# EAGLE design binary_watch_shield_v1 (EAGLE 6.5.0)
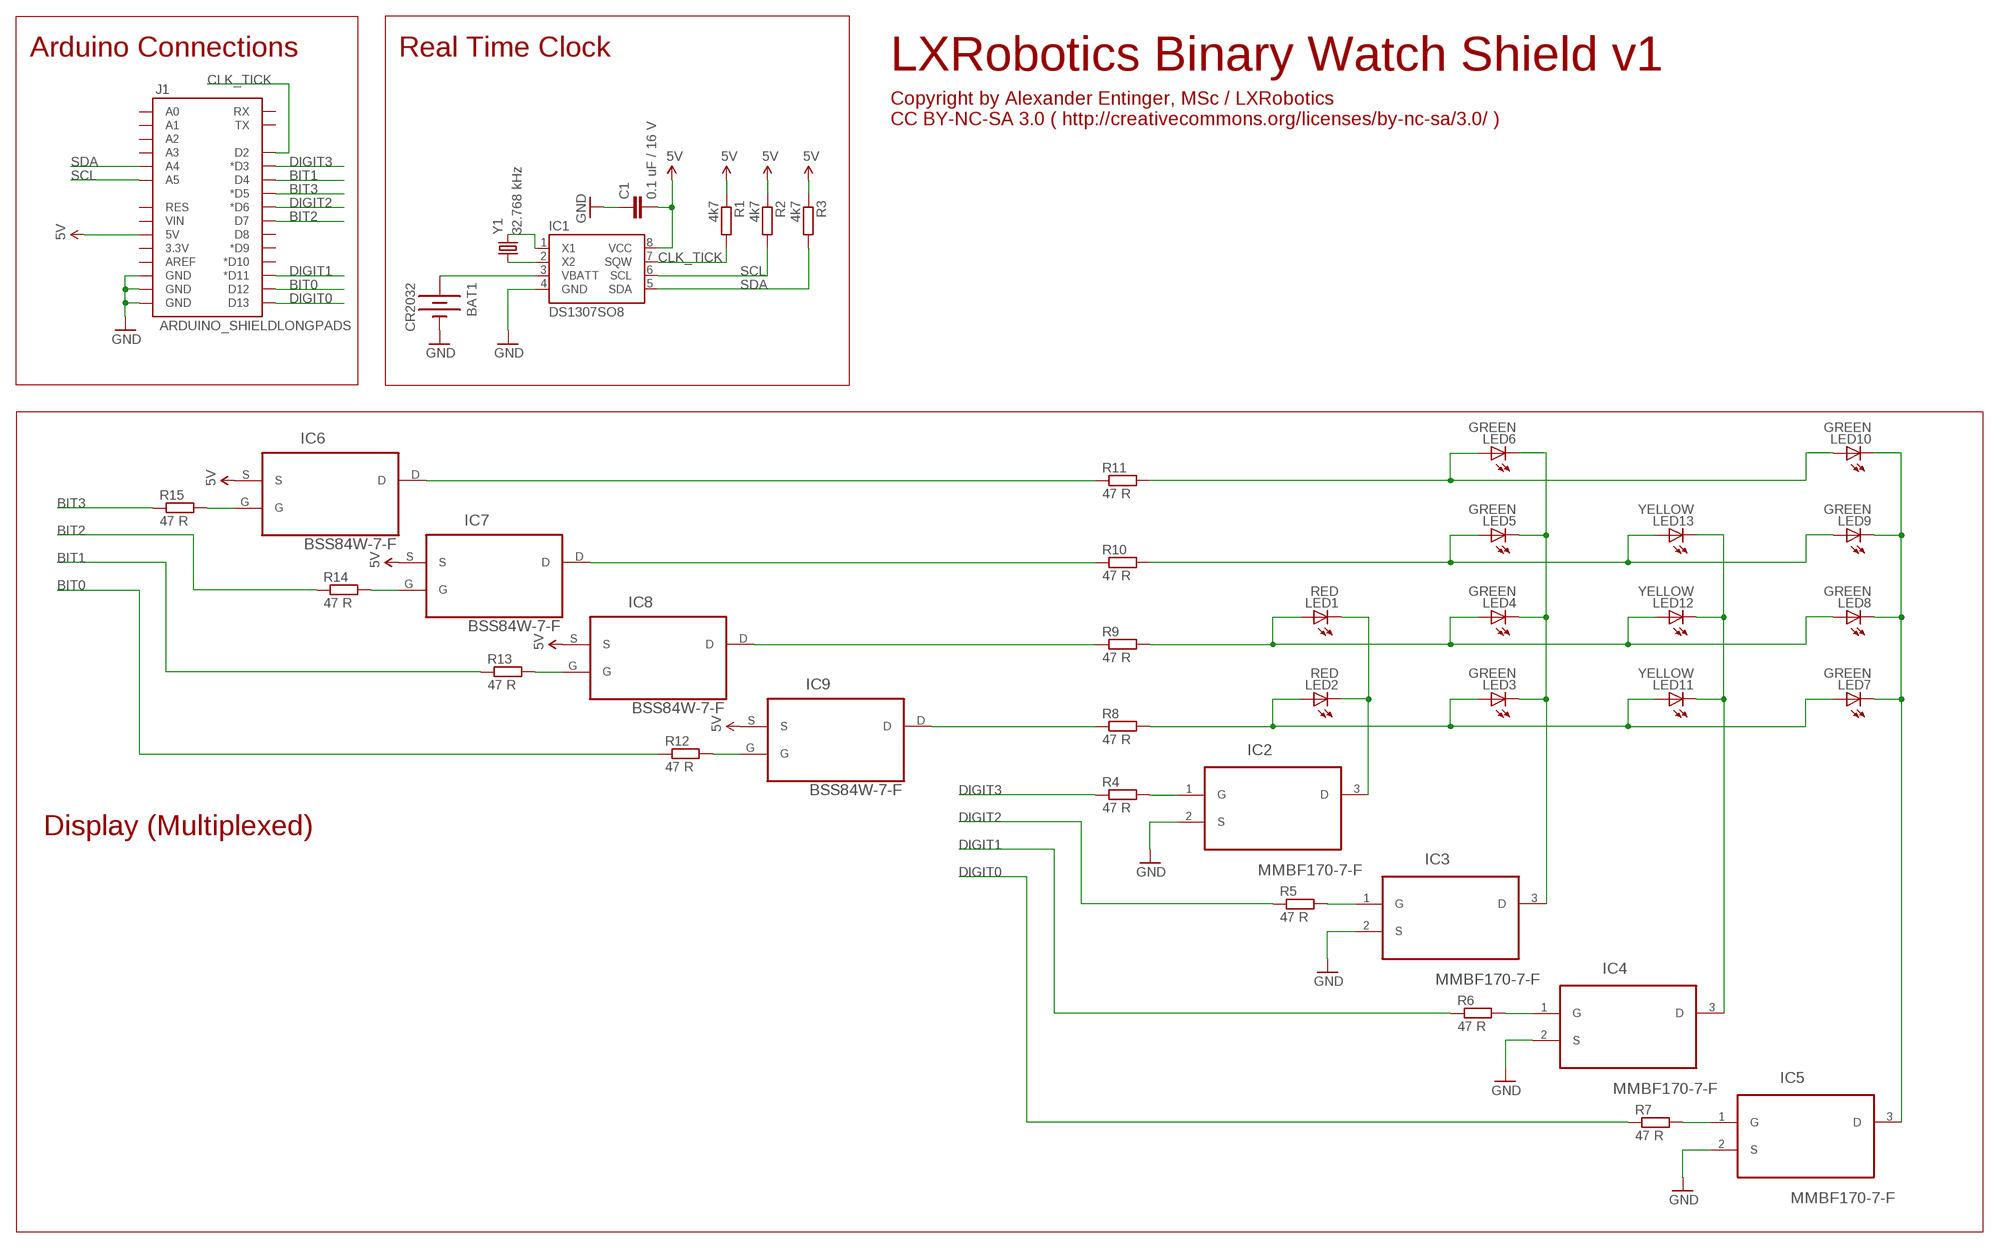
[diagram p0: schematic, sheet 1]

## Parts
BAT1  CR2032  BATTERY20SMD  [BATTCON_20MM]
C1  0.1 uF / 16 V  C-EUC0805  [C0805]
IC1  DS1307SO8  [SO08]
IC2  MMBF170-7-F  [SOT103P240X110-3N]
IC3  MMBF170-7-F  [SOT103P240X110-3N]
IC4  MMBF170-7-F  [SOT103P240X110-3N]
IC5  MMBF170-7-F  [SOT103P240X110-3N]
IC6  BSS84W-7-F  [SOT65P210X110-3N]
IC7  BSS84W-7-F  [SOT65P210X110-3N]
IC8  BSS84W-7-F  [SOT65P210X110-3N]
IC9  BSS84W-7-F  [SOT65P210X110-3N]
J1  ARDUINO_SHIELDLONGPADS  [DUEMILANOVE_SHIELD_LONGPADS]
LED1  RED  LED5MM  [LED5MM]
LED2  RED  LED5MM  [LED5MM]
LED3  GREEN  LED5MM  [LED5MM]
LED4  GREEN  LED5MM  [LED5MM]
LED5  GREEN  LED5MM  [LED5MM]
LED6  GREEN  LED5MM  [LED5MM]
LED7  GREEN  LED5MM  [LED5MM]
LED8  GREEN  LED5MM  [LED5MM]
LED9  GREEN  LED5MM  [LED5MM]
LED10  GREEN  LED5MM  [LED5MM]
LED11  YELLOW  LED5MM  [LED5MM]
LED12  YELLOW  LED5MM  [LED5MM]
LED13  YELLOW  LED5MM  [LED5MM]
R1  4k7  R-EU_R0805  [R0805]
R2  4k7  R-EU_R0805  [R0805]
R3  4k7  R-EU_R0805  [R0805]
R4  47 R  R-EU_R0805  [R0805]
R5  47 R  R-EU_R0805  [R0805]
R6  47 R  R-EU_R0805  [R0805]
R7  47 R  R-EU_R0805  [R0805]
R8  47 R  R-EU_R0805  [R0805]
R9  47 R  R-EU_R0805  [R0805]
R10  47 R  R-EU_R0805  [R0805]
R11  47 R  R-EU_R0805  [R0805]
R12  47 R  R-EU_R0805  [R0805]
R13  47 R  R-EU_R0805  [R0805]
R14  47 R  R-EU_R0805  [R0805]
R15  47 R  R-EU_R0805  [R0805]
Y1  32.768 kHz  CRYSTALTC26H_EZ  [TC26HEZ]

## Nets
5V: C1.2 IC1.8(VCC) IC6.S IC7.S IC8.S IC9.S J1.5V R1.1 R2.1 R3.1
BIT0: J1.D12 R12.1
BIT1: J1.D4 R13.1
BIT2: J1.D7 R14.1
BIT3: J1.D5(*D5) R15.1
CLK_TICK: IC1.7(SQW) J1.D2 R1.2
DIGIT0: J1.D13 R7.1
DIGIT1: J1.D11(*D11) R6.1
DIGIT2: J1.D6(*D6) R5.1
DIGIT3: J1.D3(*D3) R4.1
GND: BAT1.2(-) C1.1 IC1.4(GND) IC2.2(S) IC3.2(S) IC4.2(S) IC5.2(S) J1.GND@0(GND) J1.GND@1(GND) J1.GND@2(GND)
N$1: IC2.3(D) LED1.K(C) LED2.K(C)
N$2: IC3.3(D) LED3.K(C) LED4.K(C) LED5.K(C) LED6.K(C)
N$3: IC4.3(D) LED11.K(C) LED12.K(C) LED13.K(C)
N$4: IC1.2(X2) Y1.1
N$5: IC1.1(X1) Y1.2
N$6: IC5.3(D) LED7.K(C) LED8.K(C) LED9.K(C) LED10.K(C)
N$7: LED5.A LED9.A LED13.A R10.2
N$8: LED2.A LED3.A LED7.A LED11.A R8.2
N$9: LED1.A LED4.A LED8.A LED12.A R9.2
N$10: LED6.A LED10.A R11.2
N$11: IC2.1(G) R4.2
N$12: IC3.1(G) R5.2
N$13: IC4.1(G) R6.2
N$14: IC5.1(G) R7.2
N$15: IC9.D R8.1
N$16: IC8.D R9.1
N$17: IC7.D R10.1
N$18: IC6.D R11.1
N$19: IC6.G R15.2
N$20: IC7.G R14.2
N$21: IC8.G R13.2
N$22: IC9.G R12.2
N$23: BAT1.1(+) IC1.3(VBATT)
SCL: IC1.6(SCL) J1.A5 R2.2
SDA: IC1.5(SDA) J1.A4 R3.2
Unconnected: J1.3.3V J1.A0 J1.A1 J1.A2 J1.A3 J1.AREF J1.D8 J1.D9(*D9) J1.D10(*D10) J1.RES J1.RX J1.TX J1.VIN

## Notes on the sheet
- Arduino Connections | Real Time Clock
- LXRobotics Binary Watch Shield v1
- Copyright by Alexander Entinger, MSc / LXRobotics
  CC BY-NC-SA 3.0 ( http://creativecommons.org/licenses/by-nc-sa/3.0/ )
- Display (Multiplexed)

## Library data of the parts
BAT1 = SparkFun-Electromechanical:BATTERY: Battery Holders Various common sizes : AA, AAA, 20mm coin cell and 12mm coin cell. 20MM_4LEGS, BATT-10373
C1 = resistor:C-EU: CAPACITOR, European symbol
IC1 = SparkFun-FreqCtrl:DS1307: I2C real-time clock with battery backup.
IC2-IC5 = lxrobotics_ic:MMBF170-7-F: N-CHANNEL ENHANCEMENT MODE FIELD EFFECT TRANSISTOR; MPN: MMBF170-7-F; OC_FARNELL: 1773582; OC_NEWARK: 51R6804; PACKAGE: SOT-23-3; SUPPLIER: DIODES INC.
IC6-IC9 = lxrobotics_ic:BSS84W-7-F: P-CHANNEL ENHANCEMENT MODE MOSFET
J1 = SparkFun-Boards:ARDUINO_SHIELD: Arduino shield footprint
LED1-LED13 = led:LED: LED OSRAM: - CHIPLED LG R971, LG N971, LY N971, LG Q971, LY Q971, LO R971, LY R971 LH N974, LH R974 LS Q976, LO Q976, LY Q976 LO Q996 - Hyper CHIPLED LW Q18S LB Q993, LB Q99A, LB R99A - SideLED LS A670, LO A670, LY A670, LG A670, LP A670 LB A673, LV A673, LT A673, LW A673 LH A674 LY A675 LS A676, LA A676, LO A676, LY A676, LW A676 LS A679, LY A679, LG A679 - Hyper Micro SIDELED® LS Y876, LA Y876, LO Y876, LY Y876 LT Y87S - SmartLED LW L88C, LW L88S LB L89C, LB L89S, LG L890 LS L89K, LO L89K, LY L89K LS L896, LA L896, LO L896, LY L896 - TOPLED LS T670, LO T670, LY T670, LG T670, LP T670 LSG T670, LSP T670, LSY T670, LOP T670, LYG T670 LG T671, LOG T671, LSG T671 LB T673, LV T673, LT T673, LW T673 LH T674 LS T676, LA T676, LO T676, LY T676, LB T676, LH T676, LSB T676, LW T676 LB T67C, LV T67C, LT T67C, LS T67K, LO T67K, LY T67K, LW E67C LS E67B, LA E67B, LO E67B, LY E67B, LB E67C, LV E67C, LT E67C LW T67C LS T679, LY T679, LG T679 LS T770, LO T770, LY T770, LG T770, LP T770 LB T773, LV T773, LT T773, LW T773 LH T774 LS E675, LA E675, LY E675, LS T675 LS T776, LA T776, LO T776, LY T776, LB T776 LHGB T686 LT T68C, LB T68C - Hyper Mini TOPLED® LB M676 - Mini TOPLED Santana® LG M470 LS M47K, LO M47K, LY M47K Source: http://www.osram.convergy.de LUXEON: - LUMILED® LXK2-PW12-R00, LXK2-PW12-S00, LXK2-PW14-U00, LXK2-PW14-V00 LXK2-PM12-R00, LXK2-PM12-S00, LXK2-PM14-U00 LXK2-PE12-Q00, LXK2-PE12-R00, LXK2-PE12-S00, LXK2-PE14-T00, LXK2-PE14-U00 LXK2-PB12-K00, LXK2-PB12-L00, LXK2-PB12-M00, LXK2-PB14-N00, LXK2-PB14-P00, LXK2-PB14-Q00 LXK2-PR12-L00, LXK2-PR12-M00, LXK2-PR14-Q00, LXK2-PR14-R00 LXK2-PD12-Q00, LXK2-PD12-R00, LXK2-PD12-S00 LXK2-PH12-R00, LXK2-PH12-S00 LXK2-PL12-P00, LXK2-PL12-Q00, LXK2-PL12-R00 Source: www.luxeon.com KINGBRIGHT: KA-3528ASYC Source: www.kingbright.com
R1-R15 = resistor:R-EU_: RESISTOR, European symbol
Y1 = SparkFun-FreqCtrl:CRYSTAL: Various standard crystals. Proven footprints. Spark Fun Electronics SKU : COM-00534

## Board
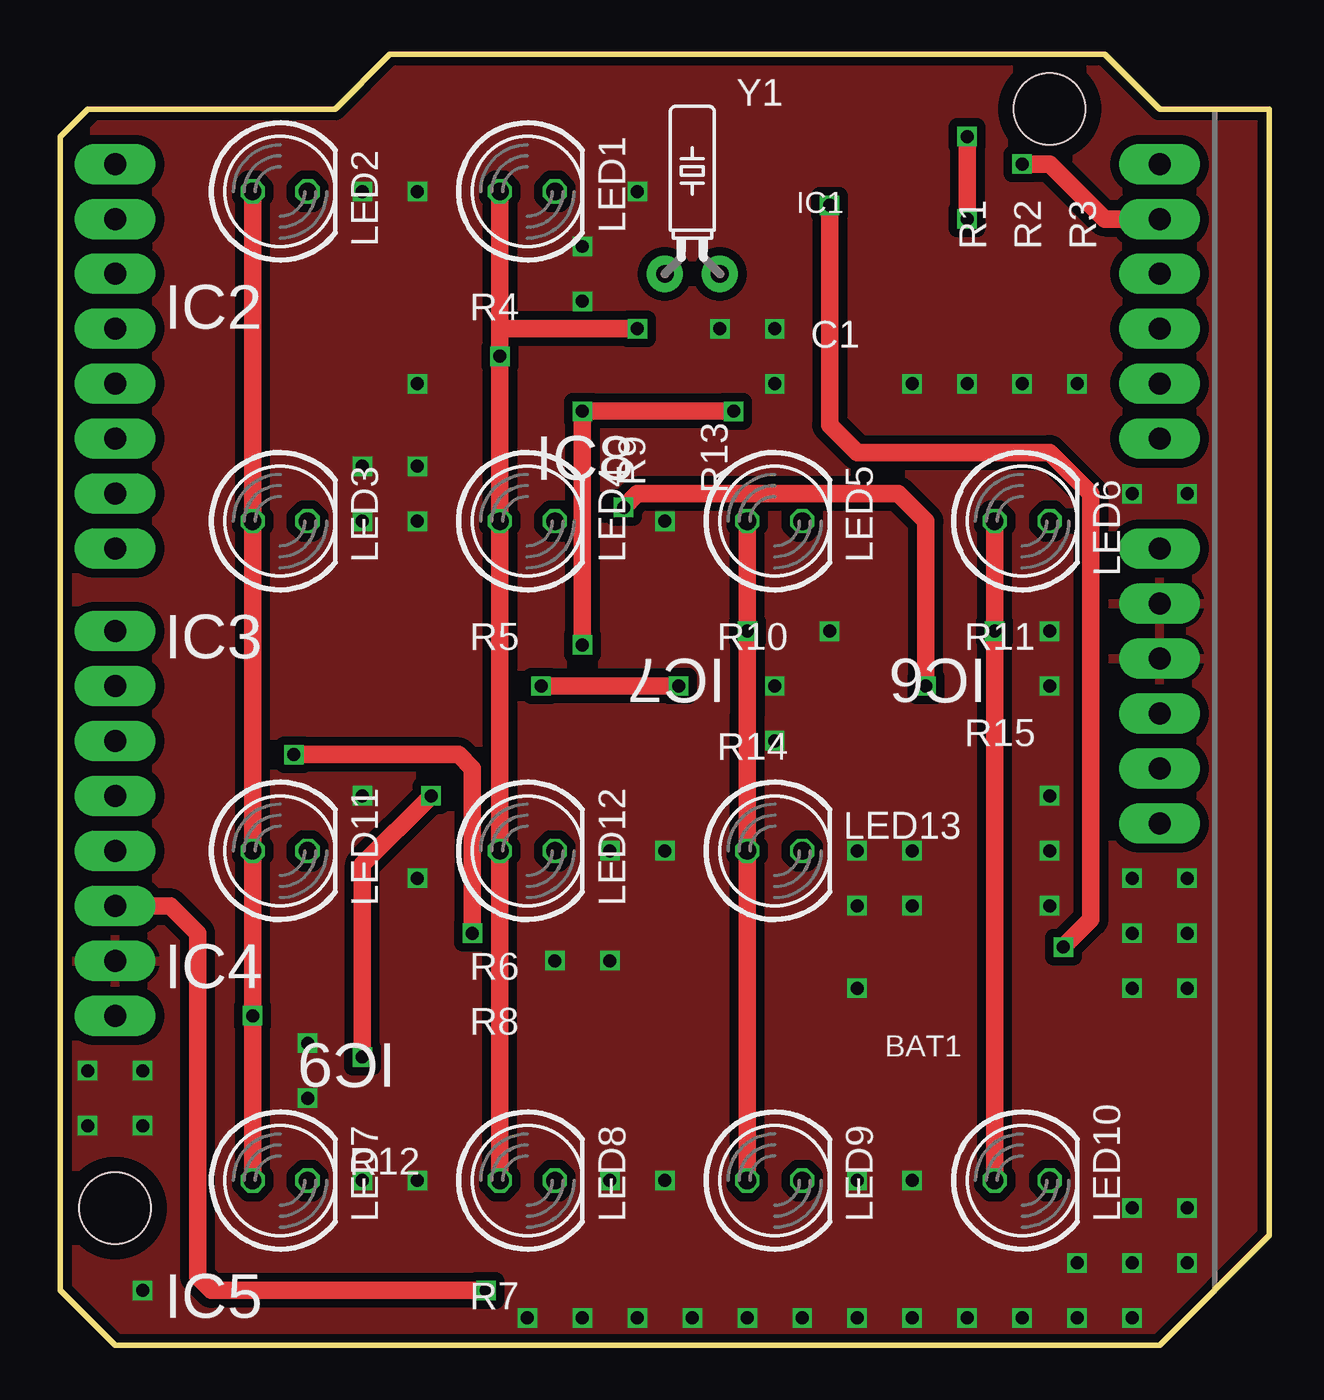
[diagram p1: board, top side]
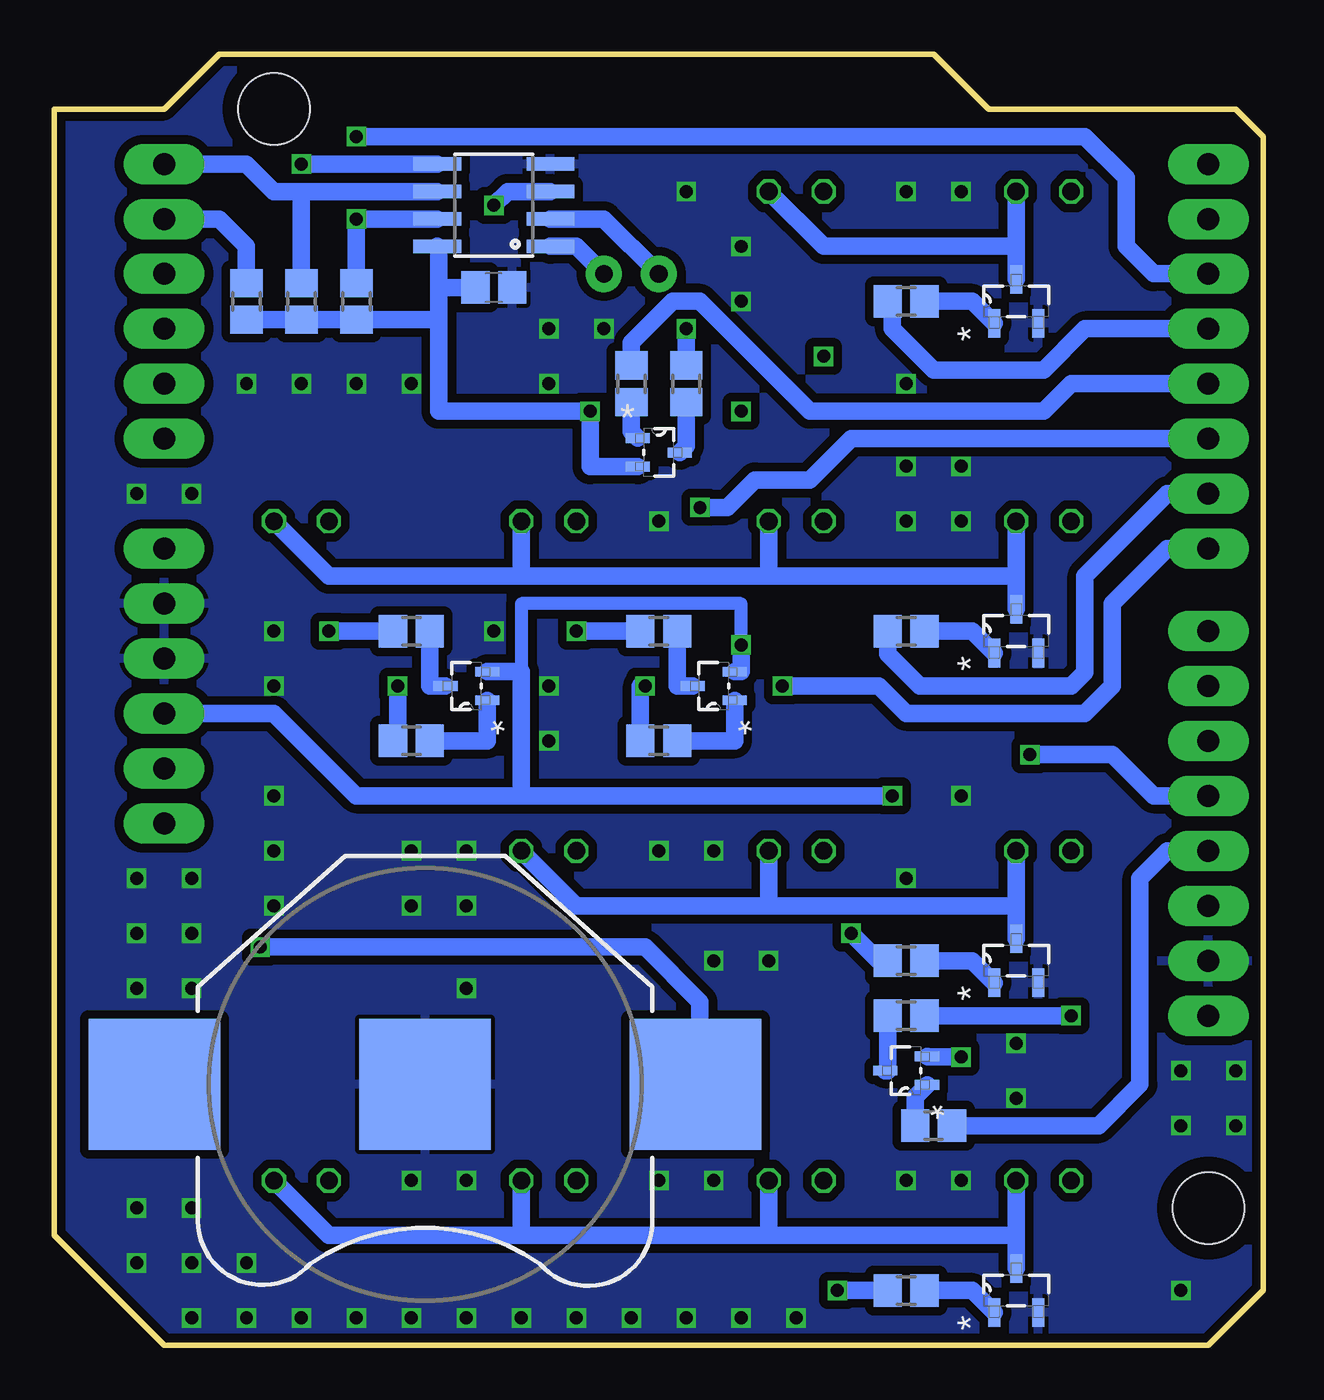
[diagram p2: board, bottom side, seen from below]

Size 55.88 x 59.69 mm. Coordinates in mm from the lower left corner, seen from the top.
Outline: 0,2.54 2.54,0 50.8,0 55.88,5.08 55.88,57.15 50.8,57.15 48.26,59.69 15.24,59.69 12.7,57.15 1.27,57.15 0,55.88 0,2.54
Copper layers (1*16): Top 0.035mm / dielectric 1.5mm / Bottom 0.035mm
Design rules "LeitOn - Standard-Eagle-DRU - 1- und  2-Lagen DK - deutsch - Rev 2.0": minimum track width 0.15mm, minimum drill 0.3mm, track to track 0.15mm, track to pad 0.15mm, pad to pad 0.15mm, via to via 0.15mm, smd to smd 0.15mm, copper to edge 0.3mm, drill to drill 0.3mm, minimum pad ring 0.15mm, minimum via ring 0.15mm, stop-mask expansion 0.075mm, vias tented up to drill 0mil, thermal gap 0.2mm

### Footprints (pad centres in the part's own frame; a part is rotated, then mirrored left to right if it is on the bottom)
BATTCON_20MM = smd 6.07 x 6.07: 1 -12.5,0; 2 0,0; 3 12.5,0
C0805 = smd 1.3 x 1.5: 1 -0.85,0; 2 0.85,0
SO08 = smd 0.61 x 2.21: 1 -1.905,-2.616; 2 -0.635,-2.616; 3 0.635,-2.616; 4 1.905,-2.616; 5 1.905,2.616; 6 0.635,2.616; 7 -0.635,2.616; 8 -1.905,2.616
SOT103P240X110-3N = smd 1.321 x 0.559: 1 -1.016,1.016; 2 -1.016,-1.016; 3 1.016,0
SOT65P210X110-3N = smd 1.118 x 0.457: D 0.965,0; G -0.965,0.66; S -0.965,-0.66
DUEMILANOVE_SHIELD_LONGPADS = drill 1.016 pad 1.88 long: 3.3V 50.8,26.67; 5V 50.8,29.21; A0 50.8,41.91; A1 50.8,44.45; A2 50.8,46.99; A3 50.8,49.53; A4 50.8,52.07; A5 50.8,54.61; AREF 2.54,15.24; D2 2.54,49.53; D3 2.54,46.99; D4 2.54,44.45; D5 2.54,41.91; D6 2.54,39.37; D7 2.54,36.83; D8 2.54,33.02; D9 2.54,30.48; D10 2.54,27.94; D11 2.54,25.4; D12 2.54,22.86; D13 2.54,20.32; GND@0 50.8,31.75; GND@1 50.8,34.29; GND@2 2.54,17.78; RES 50.8,24.13; RX 2.54,54.61; TX 2.54,52.07; VIN 50.8,36.83 | hole 3.302: 45.72,57.15; 2.54,6.35
LED5MM = drill 0.813 octagon: A -1.27,0; K 1.27,0
R0805 = smd 1.3 x 1.5: 1 -0.85,0; 2 0.85,0
TC26HEZ = drill 0.813 pad 1.676: 1 -1.27,0; 2 1.27,0

### Placement (x,y rotation side)
BAT1  38.73,12.06 180 bottom
C1  35.56,48.9 180 bottom
IC1  35.56,52.7 90 bottom
IC2  11.43,48.26 90 bottom
IC3  11.43,33.02 90 bottom
IC4  11.43,17.78 90 bottom
IC5  11.43,2.54 90 bottom
IC6  36.83,30.48 180 bottom
IC7  25.4,30.48 180 bottom
IC8  27.94,41.27 0 bottom
IC9  16.51,12.7 180 bottom
J1  0,0 0 top
LED1  21.59,53.34 0 top
LED2  10.16,53.34 0 top
LED3  10.16,38.1 0 top
LED4  21.59,38.1 0 top
LED5  33.02,38.1 0 top
LED6  44.45,38.1 0 top
LED7  10.16,7.62 0 top
LED8  21.59,7.62 0 top
LED9  33.02,7.62 0 top
LED10  44.45,7.62 0 top
LED11  10.16,22.86 0 top
LED12  21.59,22.86 0 top
LED13  33.02,22.86 0 top
R1  41.91,48.26 90 bottom
R2  44.45,48.26 90 bottom
R3  46.99,48.26 90 bottom
R4  16.51,48.26 0 bottom
R5  16.51,33.02 0 bottom
R6  16.51,17.78 0 bottom
R7  16.51,2.54 0 bottom
R8  16.51,15.24 0 bottom
R9  26.67,44.45 90 bottom
R10  27.94,33.02 180 bottom
R11  39.37,33.02 180 bottom
R12  15.24,10.16 180 bottom
R13  29.21,44.45 270 bottom
R14  27.94,27.94 0 bottom
R15  39.37,27.94 0 bottom
Y1  29.21,49.53 0 top

### Tracks (layer width: path | path; a pad name or v marks a point on that pad's centre or on a via)
5V  (via drill 0.6)
  Top 0.813: v13.97,13.33 13.97,22.23 v17.15,25.4 | v31.12,43.18 v24.13,43.18 24.13,33.02 v24.13,32.39
  Bottom 0.61: v24.13,32.39 24.13,34.29 34.29,34.29 34.29,31.14
  Bottom 0.813: R3.1 R2.1 R1.1 38.1,47.41 | J1.5V 45.72,29.21 41.91,25.4 34.29,25.4 | 34.29,25.4 v17.15,25.4 | IC1.8 38.1,50.72 38.1,48.9 | 38.1,48.9 38.1,47.41 | C1.2 38.1,48.9 | 38.1,47.41 38.1,43.18 v31.12,43.18 31.12,40.62 IC8.S | IC9.S 15.52,13.33 v13.97,13.33 | IC7.S 24.13,31.14 v24.13,32.39 | IC6.S 34.29,31.14 34.29,25.4
BIT0
  Bottom 0.813: R12.1 7.62,10.16 5.71,12.06 5.71,21.59 4.45,22.86 J1.D12
BIT1
  Bottom 0.813: J1.D4 8.89,44.45 10.16,43.18 20.95,43.18 26.03,48.26 27.3,48.26 29.21,46.36 R13.1
BIT2  (via drill 0.6)
  Top 0.813: v28.57,30.48 v22.23,30.48
  Bottom 0.813: R14.1 28.79,30.48 v28.57,30.48 | v22.23,30.48 17.78,30.48 16.51,29.21 8.26,29.21 6.99,30.48 6.99,34.29 4.45,36.83 J1.D7
BIT3  (via drill 0.6)
  Top 0.813: v40,30.48 40,38.1 38.73,39.37 26.67,39.37 v26.03,38.73
  Bottom 0.813: R15.1 arc-90 40,28.16 v40,30.48 | v26.03,38.73 24.77,38.73 23.49,40.01 20.95,40.01 19.05,41.91 J1.D5
CLK_TICK  (via drill 0.6)
  Top 0.813: v41.91,55.88 v41.91,52.07
  Bottom 0.813: IC1.7 v41.91,52.07 R1.2 | J1.D2 5.08,49.53 6.35,50.8 6.35,53.98 8.26,55.88 v41.91,55.88
DIGIT0  (via drill 0.6)
  Top 0.813: J1.D13 5.08,20.32 6.35,19.05 6.35,3.18 6.99,2.54 v19.69,2.54
  Bottom 0.813: R7.1 v19.69,2.54
DIGIT1  (via drill 0.6)
  Top 0.813: v19.05,19.05 19.05,26.67 18.41,27.3 v10.79,27.3
  Bottom 0.813: R6.1 17.78,17.78 v19.05,19.05 | v10.79,27.3 6.99,27.3 5.08,25.4 J1.D11
DIGIT2
  Bottom 0.813: R5.1 17.36,31.97 15.88,30.48 8.89,30.48 8.26,31.12 8.26,35.56 4.45,39.37 J1.D6
DIGIT3
  Bottom 0.813: J1.D3 8.26,46.99 10.16,45.09 15.24,45.09 17.15,46.99 17.15,48.05 R4.1
GND  (via drill 0.6)
  other vias: 1.27,12.7 3.81,12.7 1.27,10.16 3.81,10.16 36.83,16.51 3.81,2.54 13.97,7.62 16.51,7.62 11.43,11.43 11.43,13.97 25.4,7.62 27.94,7.62 36.83,7.62 39.37,7.62 21.59,1.27 24.13,1.27 26.67,1.27 29.21,1.27 31.75,1.27 34.29,1.27 36.83,1.27 39.37,1.27 41.91,1.27 44.45,1.27 46.99,1.27 46.99,3.81 49.53,1.27 49.53,3.81 49.53,6.35 52.07,6.35 52.07,3.81 52.07,16.51 49.53,16.51 52.07,19.05 52.07,21.59 49.53,19.05 49.53,21.59 25.4,17.78 22.86,17.78 16.51,21.59 13.97,25.4 25.4,22.86 27.94,22.86 36.83,22.86 39.37,22.86 39.37,20.32 36.83,20.32 45.72,20.32 45.72,22.86 45.72,25.4 45.72,30.48 45.72,33.02 33.02,27.94 33.02,30.48 35.56,33.02 27.94,38.1 16.51,38.1 13.97,38.1 13.97,40.64 16.51,40.64 16.51,44.45 49.53,39.37 52.07,39.37 46.99,44.45 44.45,44.45 41.91,44.45 39.37,44.45 33.02,44.45 33.02,46.99 30.48,46.99 24.13,48.26 24.13,50.8 26.67,53.34 16.51,53.34 13.97,53.34
  pour Bottom (isolate 0.406): 0.64,2.54 2.54,0.63 50.8,0.63 55.24,5.08 55.24,56.52 50.8,56.52 48.26,59.06 15.24,59.06 12.7,56.52 1.91,56.52 0.64,55.25
  pour Top (isolate 0.406): 0.64,2.54 2.54,0.63 50.8,0.63 55.24,5.08 55.24,56.52 50.8,56.52 48.26,59.06 15.24,59.06 12.7,56.52 1.91,56.52 0.64,55.25
N$1
  Bottom 0.813: LED1.K 20.32,50.8 11.43,50.8 | 11.43,50.8 LED2.K | IC2.3 11.43,50.8
N$2
  Bottom 0.813: LED6.K 43.18,35.56 34.29,35.56 | 34.29,35.56 22.86,35.56 | 22.86,35.56 11.43,35.56 | 11.43,35.56 LED3.K | LED4.K 22.86,35.56 | LED5.K 34.29,35.56 | IC3.3 11.43,35.56
N$3
  Bottom 0.813: LED13.K 31.75,20.32 22.86,20.32 | 22.86,20.32 11.43,20.32 | 11.43,20.32 LED11.K | LED12.K 22.86,20.32 | IC4.3 11.43,20.32
N$4
  Bottom 0.813: Y1.1 30.48,52.07 IC1.2
N$5
  Bottom 0.813: Y1.2 31.75,50.8 IC1.1
N$6
  Bottom 0.813: LED10.K 43.18,5.08 34.29,5.08 | 34.29,5.08 22.86,5.08 | 22.86,5.08 11.43,5.08 | 11.43,5.08 11.43,6.35 LED7.K | LED8.K 22.86,5.08 | LED9.K 34.29,5.08 | IC5.3 11.43,5.08
N$7  (via drill 0.6)
  Top 0.813: LED9.A LED13.A 31.75,29.21 v31.75,33.02 LED5.A
  Bottom 0.813: R10.2 v31.75,33.02
N$8  (via drill 0.6)
  Top 0.813: LED7.A v8.89,15.24 8.89,21.59 LED11.A LED3.A LED2.A
  Bottom 0.813: R8.2 v8.89,15.24
N$9  (via drill 0.6)
  Top 0.813: LED1.A 20.32,46.99 | 20.32,46.99 v20.32,45.72 LED4.A LED12.A LED8.A | v26.67,46.99 20.32,46.99
  Bottom 0.813: R9.2 v26.67,46.99
N$10  (via drill 0.6)
  Top 0.813: LED10.A v43.18,33.02 LED6.A
  Bottom 0.813: R11.2 v43.18,33.02
N$11
  Bottom 0.813: IC2.1 13.46,48.26 R4.2
N$12
  Bottom 0.813: IC3.1 13.46,33.02 R5.2
N$13
  Bottom 0.813: IC4.1 13.46,17.78 R6.2
N$14
  Bottom 0.813: IC5.1 13.46,2.54 R7.2
N$15
  Bottom 0.813: IC9.D 17.36,12.7 R8.1
N$16
  Bottom 0.813: R9.1 26.67,41.58 IC8.D
N$17
  Bottom 0.813: IC7.D 27.09,30.48 R10.1
N$18
  Bottom 0.813: IC6.D 38.52,30.48 R11.1
N$19
  Bottom 0.813: R15.2 35.87,27.94 IC6.G
N$20
  Bottom 0.813: R14.2 24.44,27.94 IC7.G
N$21
  Bottom 0.813: R13.2 29.21,42.24 IC8.G
N$22
  Bottom 0.813: R12.2 16.09,11.49 IC9.G
N$23  (via drill 0.6)
  Top 0.813: v35.56,52.7 35.56,42.55 36.83,41.27 45.72,41.27 47.62,39.37 47.62,19.69 v46.35,18.41
  Bottom 0.813: IC1.3 34.92,53.34 v35.56,52.7 | v46.35,18.41 28.57,18.41 26.03,15.87 26.03,12.06 26.67,11.43 26.67,11.63 BAT1.1
SCL
  Bottom 0.813: R2.2 44.45,53.34 | J1.A5 46.99,54.61 45.72,53.34 44.45,53.34 | IC1.6 44.45,53.34
SDA  (via drill 0.6)
  Top 0.813: v44.45,54.61 45.72,54.61 48.26,52.07 J1.A4
  Bottom 0.813: R3.2 46.99,50.8 48.26,52.07 J1.A4 | IC1.5 v44.45,54.61